# EAGLE schematic TAMSAT_OBC_v113 (EAGLE 6.5.0)

## Sheet 1 of 4
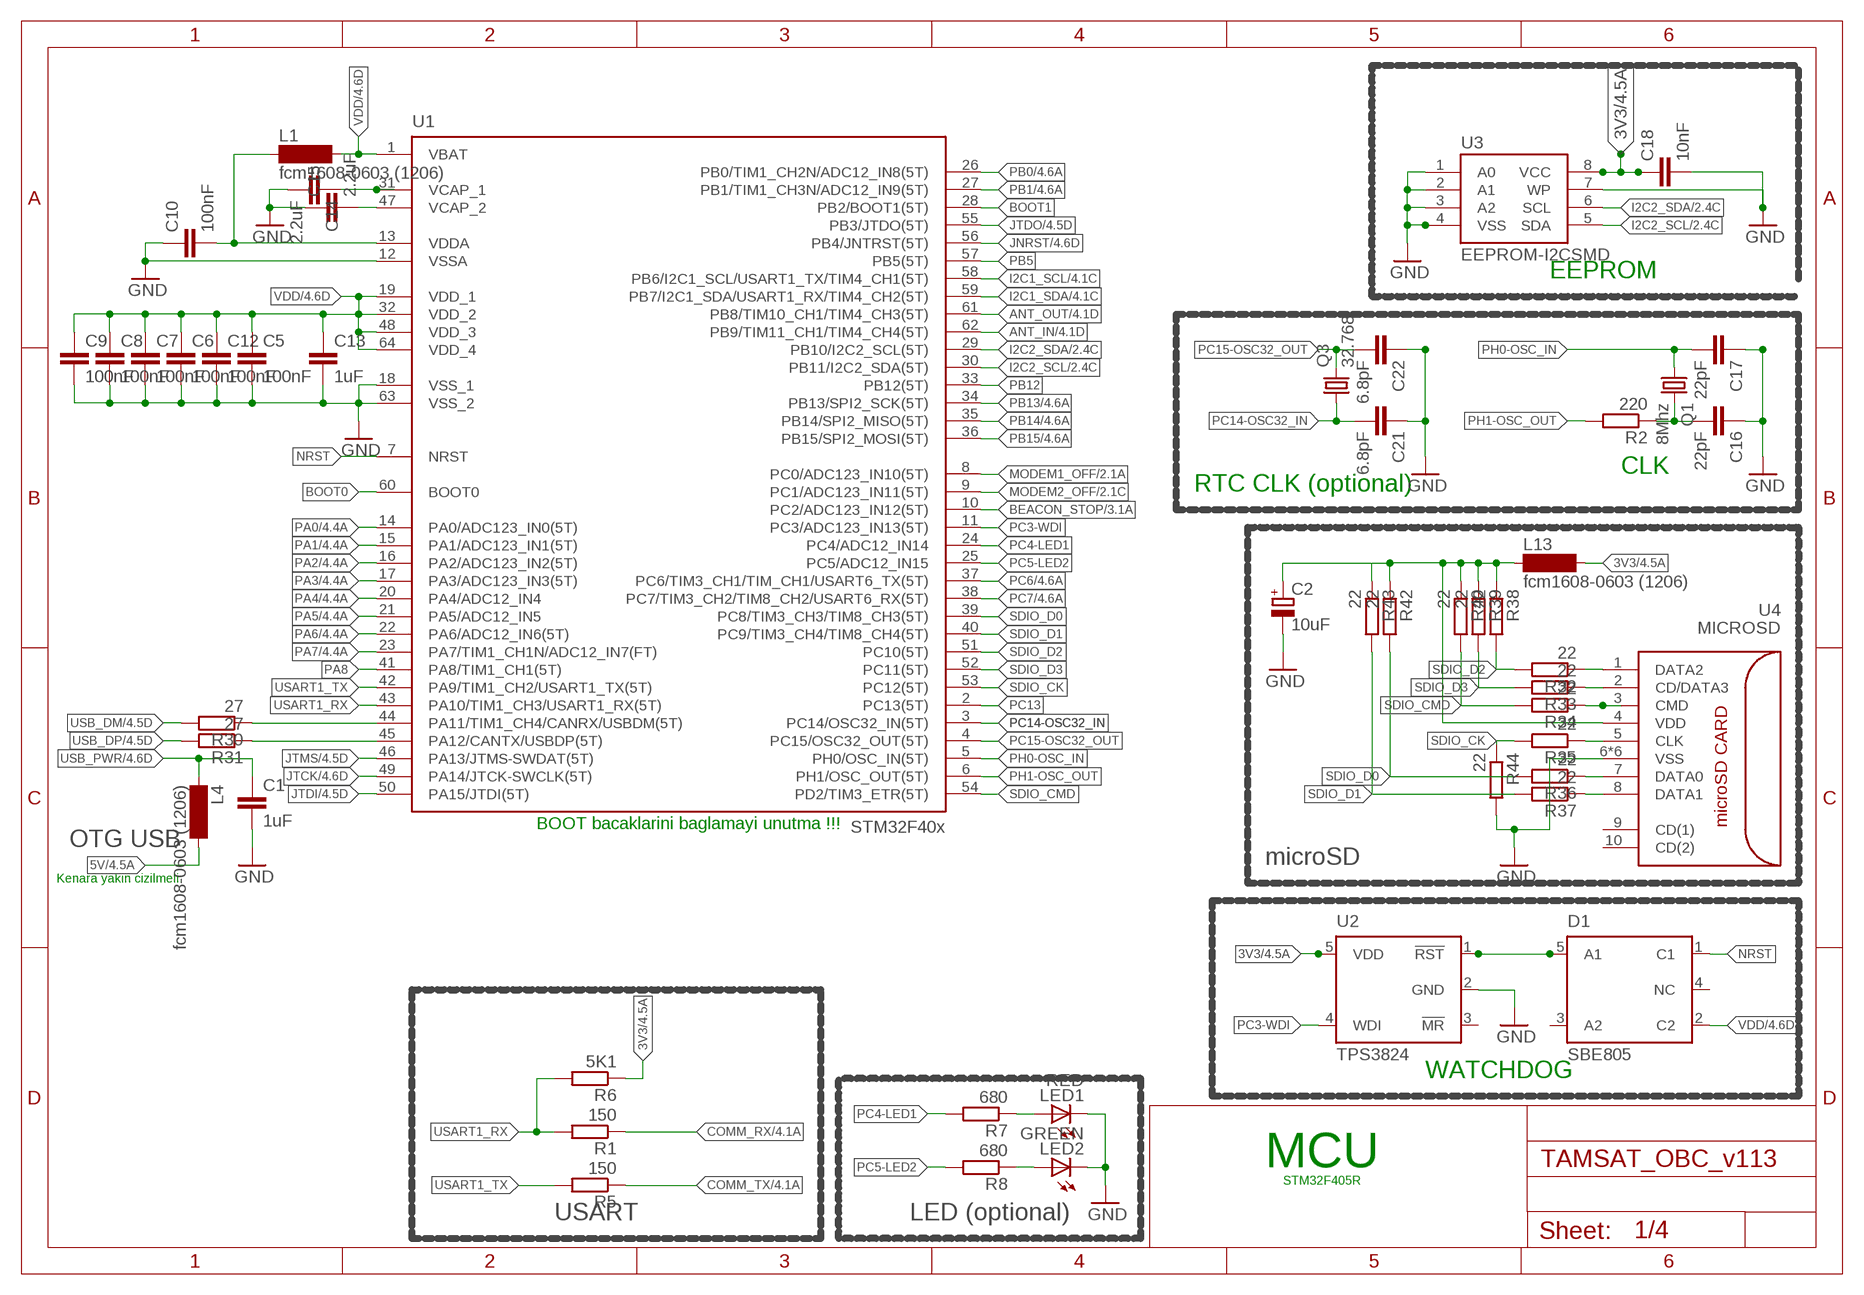
[diagram p0: schematic, sheet 1]

### Parts
C1  1uF  C-EUC0603K  [C0603K]
C2  10uF  C-TANTAL-A  [C1206(3216)]
C5  100nF  C-EUC0402K  [C0402K]
C6  100nF  C-EUC0402K  [C0402K]
C7  100nF  C-EUC0402K  [C0402K]
C8  100nF  C-EUC0402K  [C0402K]
C9  100nF  C-EUC0402K  [C0402K]
C10  100nF  C-EUC0603K  [C0603K]
C12  100nF  C-EUC0402K  [C0402K]
C13  1uF  C-EUC0805  [C0805]
C14  2.2uF  C-EUC0402K  [C0402K]
C15  2.2uF  C-EUC0402K  [C0402K]
C16  22pF  C-EUC0402K  [C0402K]
C17  22pF  C-EUC0402K  [C0402K]
C18  10nF  CAP0805  [0805]
C21  6.8pF  C-EUC0402K  [C0402K]
C22  6.8pF  C-EUC0402K  [C0402K]
D1  SBE805  [SOT-25]
L1  fcm1608-0603 (1206)  SM-1206  [SM-1206]
L4  fcm1608-0603 (1206)  SM-1206  [SM-1206]
L13  fcm1608-0603 (1206)  SM-1206  [SM-1206]
LED1  RED  LEDCHIPLED_0603  [CHIPLED_0603]
LED2  GREEN  LEDCHIP-LED0603  [CHIP-LED0603]
Q1  8Mhz  XTAL_8MHZ  [XTAL_SMD2]
Q3  32.768  MC-306  [MC-306]
R1  150  R-EU_R0402  [R0402]
R2  220  R-EU_R0402  [R0402]
R5  150  R-EU_R0402  [R0402]
R6  5K1  R-EU_R0402  [R0402]
R7  680  R-EU_R0402  [R0402]
R8  680  R-EU_R0402  [R0402]
R30  27  R-EU_R0402  [R0402]
R31  27  R-EU_R0402  [R0402]
R32  22  R-EU_R0402  [R0402]
R33  22  R-EU_R0402  [R0402]
R34  22  R-EU_R0402  [R0402]
R35  22  R-EU_R0402  [R0402]
R36  22  R-EU_R0402  [R0402]
R37  22  R-EU_R0402  [R0402]
R38  22  R-EU_R0402  [R0402]
R39  22  R-EU_R0402  [R0402]
R40  22  R-EU_R0402  [R0402]
R42  22  R-EU_R0402  [R0402]
R43  22  R-EU_R0402  [R0402]
R44  22  R-EU_R0402  [R0402]
U1  STM32F405R  [TQFP64]
U2  TPS3824  [SOT23-5]
U3  EEPROM-I2CSMD  [SO08]
U4  MICROSD  [MICROSD]

### Nets
3V3: C18.1 L13.2 R6.1 U2.5(VDD) U3.8(VCC) ; also sheet 4
5V: L4.2 ; also sheet 4
ANT_IN: U1.62(PB9/TIM11_CH1/TIM4_CH4(5T)) ; also sheet 4
ANT_OUT: U1.61(PB8/TIM10_CH1/TIM4_CH3(5T)) ; also sheet 4
BEACON_STOP: U1.10(PC2/ADC123_IN12(5T)) ; also sheet 3
BOOT0: U1.60(BOOT0)
BOOT1: U1.28(PB2/BOOT1(5T))
COMM_RX: R1.1 ; also sheet 4
COMM_TX: R5.1 ; also sheet 4
GND: C1.2 C2.2(-) C5.2 C6.2 C7.2 C8.2 C9.2 C10.1 C12.2 C13.2 C14.2 C15.1 C16.1 C17.1 C18.2 C21.1 C22.1 LED1.C LED2.C R44.2 U1.12(VSSA) U1.18(VSS_1) U1.63(VSS_2) U2.2(GND) U3.1(A0) U3.2(A1) U3.3(A2) U3.4(VSS) U3.7(WP) U4.6(VSS) U4.11(VSS) U4.12(VSS) U4.13(VSS) U4.14(VSS) U4.15(VSS) ; also sheet 2,3,4
I2C1_SCL: U1.58(PB6/I2C1_SCL/USART1_TX/TIM4_CH1(5T)) ; also sheet 4
I2C1_SDA: U1.59(PB7/I2C1_SDA/USART1_RX/TIM4_CH2(5T)) ; also sheet 4
I2C2_SCL: U1.30(PB11/I2C2_SDA(5T)) U3.5(SDA) ; also sheet 2,3,4
I2C2_SDA: U1.29(PB10/I2C2_SCL(5T)) U3.6(SCL) ; also sheet 2,3,4
JNRST: U1.56(PB4/JNTRST(5T)) ; also sheet 4
JTCK: U1.49(PA14/JTCK-SWCLK(5T)) ; also sheet 4
JTDI: U1.50(PA15/JTDI(5T)) ; also sheet 4
JTDO: U1.55(PB3/JTDO(5T)) ; also sheet 4
JTMS: U1.46(PA13/JTMS-SWDAT(5T)) ; also sheet 4
MODEM1_OFF: U1.8(PC0/ADC123_IN10(5T)) ; also sheet 2
MODEM2_OFF: U1.9(PC1/ADC123_IN11(5T)) ; also sheet 2
N$1: C14.1 U1.31(VCAP_1)
N$2: C15.2 U1.47(VCAP_2)
N$3: C10.2 L1.1 U1.13(VDDA)
N$5: R36.1 U4.7(DATA0)
N$6: C16.2 Q1.2 R2.1
N$12: LED1.A R7.1
N$13: LED2.A R8.1
N$14: D1.5(A1) U2.1(!RST)
N$69: R30.1 U1.44(PA11/TIM1_CH4/CANRX/USBDM(5T))
N$70: R31.1 U1.45(PA12/CANTX/USBDP(5T))
N$71: R32.1 U4.1(DATA2)
N$72: R33.1 U4.2(CD/DATA3)
N$73: R34.1 U4.3(CMD)
N$74: C2.1(+) L13.1 R38.1 R39.1 R40.1 R42.1 R43.1 U4.4(VDD)
N$75: R35.1 U4.5(CLK)
N$76: R37.1 U4.8(DATA1)
NRST: D1.1(C1) U1.7(NRST)
PA0: U1.14(PA0/ADC123_IN0(5T)) ; also sheet 4
PA1: U1.15(PA1/ADC123_IN1(5T)) ; also sheet 4
PA2: U1.16(PA2/ADC123_IN2(5T)) ; also sheet 4
PA3: U1.17(PA3/ADC123_IN3(5T)) ; also sheet 4
PA4: U1.20(PA4/ADC12_IN4) ; also sheet 4
PA5: U1.21(PA5/ADC12_IN5) ; also sheet 4
PA6: U1.22(PA6/ADC12_IN6(5T)) ; also sheet 4
PA7: U1.23(PA7/TIM1_CH1N/ADC12_IN7(FT)) ; also sheet 4
PA8: U1.41(PA8/TIM1_CH1(5T))
PB0: U1.26(PB0/TIM1_CH2N/ADC12_IN8(5T)) ; also sheet 4
PB1: U1.27(PB1/TIM1_CH3N/ADC12_IN9(5T)) ; also sheet 4
PB5: U1.57(PB5(5T))
PB12: U1.33(PB12(5T))
PB13: U1.34(PB13/SPI2_SCK(5T)) ; also sheet 4
PB14: U1.35(PB14/SPI2_MISO(5T)) ; also sheet 4
PB15: U1.36(PB15/SPI2_MOSI(5T)) ; also sheet 4
PC3-WDI: U1.11(PC3/ADC123_IN13(5T)) U2.4(WDI)
PC4-LED1: R7.2 U1.24(PC4/ADC12_IN14)
PC5-LED2: R8.2 U1.25(PC5/ADC12_IN15)
PC6: U1.37(PC6/TIM3_CH1/TIM_CH1/USART6_TX(5T)) ; also sheet 4
PC7: U1.38(PC7/TIM3_CH2/TIM8_CH2/USART6_RX(5T)) ; also sheet 4
PC13: U1.2(PC13(5T))
PC14-OSC32_IN: C21.2 Q3.1 U1.3(PC14/OSC32_IN(5T))
PC15-OSC32_OUT: C22.2 Q3.4 U1.4(PC15/OSC32_OUT(5T))
PH0-OSC_IN: C17.2 Q1.1 U1.5(PH0/OSC_IN(5T))
PH1-OSC_OUT: R2.2 U1.6(PH1/OSC_OUT(5T))
SDIO_CK: R35.2 R44.1 U1.53(PC12(5T))
SDIO_CMD: R34.2 R40.2 U1.54(PD2/TIM3_ETR(5T))
SDIO_D0: R36.2 R42.2 U1.39(PC8/TIM3_CH3/TIM8_CH3(5T))
SDIO_D1: R37.2 R43.2 U1.40(PC9/TIM3_CH4/TIM8_CH4(5T))
SDIO_D2: R32.2 R38.2 U1.51(PC10(5T))
SDIO_D3: R33.2 R39.2 U1.52(PC11(5T))
USART1_RX: R1.2 R6.2 U1.43(PA10/TIM1_CH3/USART1_RX(5T))
USART1_TX: R5.2 U1.42(PA9/TIM1_CH2/USART1_TX(5T))
USB_DM: R30.2 ; also sheet 4
USB_DP: R31.2 ; also sheet 4
USB_PWR: C1.1 L4.1 ; also sheet 4
VDD: C5.1 C6.1 C7.1 C8.1 C9.1 C12.1 C13.1 D1.2(C2) L1.2 U1.1(VBAT) U1.19(VDD_1) U1.32(VDD_2) U1.48(VDD_3) U1.64(VDD_4) ; also sheet 4
Unconnected: D1.3(A2) D1.4(NC) U2.3(!MR) U4.9(CD(1)) U4.10(CD(2))

### Notes on the sheet
- EEPROM
- CLK
- RTC CLK (optional)
- OTG USB | BOOT bacaklarini baglamayi unutma !!!
- microSD
- Kenara yakin cizilmeli
- WATCHDOG
- MCU
- STM32F405R
- USART | LED (optional)

## Sheet 2 of 4
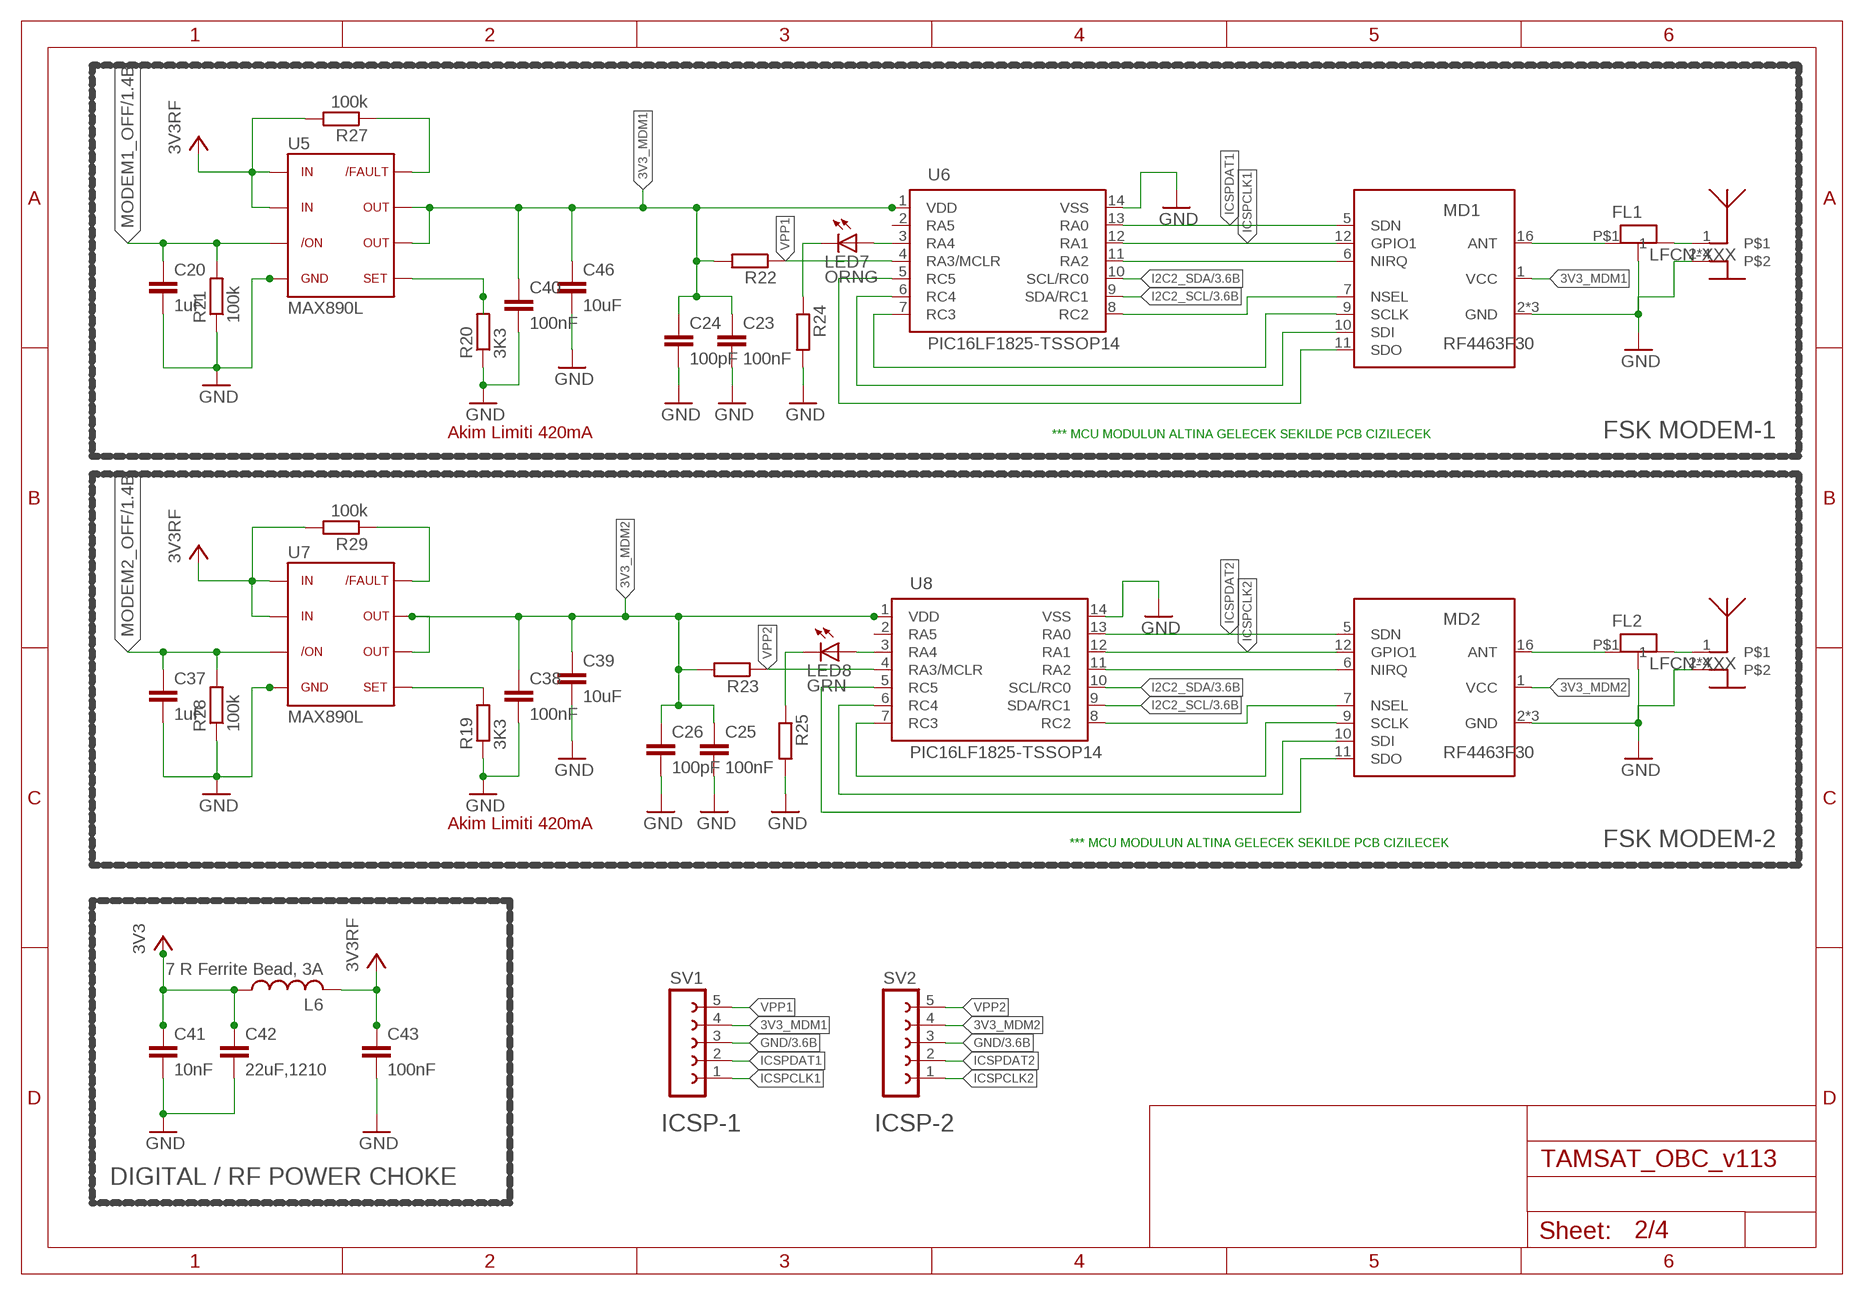
[diagram p1: schematic, sheet 2]

### Parts
C20  1uF  C-EUC0805K  [C0805K]
C23  100nF  C-EUC0805K  [C0805K]
C24  100pF  C-EUC0805K  [C0805K]
C25  100nF  C-EUC0805K  [C0805K]
C26  100pF  C-EUC0805K  [C0805K]
C37  1uF  C-EUC0805K  [C0805K]
C38  100nF  C-EUC0805K  [C0805K]
C39  10uF  C-EUC1206K  [C1206K]
C40  100nF  C-EUC0805K  [C0805K]
C41  10nF  C-EUC0805K  [C0805K]
C42  22uF,1210  C1206(3216)-GCM31  [C1206-GCM31]
C43  100nF  C-EUC0805K  [C0805K]
C46  10uF  C-EUC1206K  [C1206K]
FL1  LFCN-XXX  [LFCN-XXX]
FL2  LFCN-XXX  [LFCN-XXX]
L6  7 R Ferrite Bead, 3A  L  [L805]
LED7  ORNG  LEDCHIP-LED0805  [CHIP-LED0805]
LED8  GRN  LEDCHIP-LED0805  [CHIP-LED0805]
MD1  RF4463F30  [RF4463F30]
MD2  RF4463F30  [RF4463F30]
R19  3K3  R-EU_R0805  [R0805]
R20  3K3  R-EU_R0805  [R0805]
R21  100k  R-EU_R0805  [R0805]
R22  R-EU_R0805  [R0805]
R23  R-EU_R0805  [R0805]
R24  R-EU_R0805  [R0805]
R25  R-EU_R0805  [R0805]
R27  100k  R-EU_R0805  [R0805]
R28  100k  R-EU_R0805  [R0805]
R29  100k  R-EU_R0805  [R0805]
SV1  FE05-1  [FE05-1]
SV2  FE05-1  [FE05-1]
U5  MAX890L  [SO8]
U6  PIC16LF1825-TSSOP14  [TSSOP14]
U7  MAX890L  [SO8]
U8  PIC16LF1825-TSSOP14  [TSSOP14]
U$1  SMA-KONNEKTOR  [SMA]
U$3  SMA-KONNEKTOR  [SMA]

### Nets
3.3VBEACON: C41.1 C42.P$1 L6.1 ; supply symbol labelled 3V3
3V3_MDM1: C23.1 C24.1 C40.1 C46.1 MD1.1(VCC) R22.2 SV1.4 U5.6 U5.7 U6.1(VDD)
3V3_MDM2: C25.1 C26.1 C38.1 C39.1 MD2.1(VCC) R23.2 SV2.4 U7.6 U7.7 U8.1(VDD)
GND: C20.2 C23.2 C24.2 C25.2 C26.2 C37.2 C38.2 C39.2 C40.2 C41.2 C42.P$2 C43.2 C46.2 FL1.P$3 FL1.P$4 FL2.P$3 FL2.P$4 MD1.2(GND) MD1.8(GND) MD1.15(GND) MD2.2(GND) MD2.8(GND) MD2.15(GND) R19.1 R20.1 R21.1 R24.2 R25.2 R28.1 SV1.3 SV2.3 U5.4 U6.14(VSS) U7.4 U8.14(VSS) U$1.2 U$1.3 U$1.4 U$1.5 U$3.2 U$3.3 U$3.4 U$3.5 ; also sheet 1,3,4
I2C2_SCL: U6.9(SDA/RC1) U8.9(SDA/RC1) ; also sheet 1,3,4
I2C2_SDA: U6.10(SCL/RC0) U8.10(SCL/RC0) ; also sheet 1,3,4
ICSPCLK1: MD1.12(GPIO1) SV1.1 U6.12(RA1)
ICSPCLK2: MD2.12(GPIO1) SV2.1 U8.12(RA1)
ICSPDAT1: MD1.5(SDN) SV1.2 U6.13(RA0)
ICSPDAT2: MD2.5(SDN) SV2.2 U8.13(RA0)
MODEM1_OFF: C20.1 R21.2 U5.3 ; also sheet 1
MODEM2_OFF: C37.1 R28.2 U7.3 ; also sheet 1
N$20: FL1.P$1 MD1.16(ANT)
N$24: MD1.6(NIRQ) U6.11(RA2)
N$25: MD1.7(NSEL) U6.8(RC2)
N$26: MD1.9(SCLK) U6.7(RC3)
N$27: MD1.10(SDI) U6.6(RC4)
N$28: MD1.11(SDO) U6.5(RC5)
N$29: FL2.P$1 MD2.16(ANT)
N$34: MD2.6(NIRQ) U8.11(RA2)
N$35: MD2.7(NSEL) U8.8(RC2)
N$36: MD2.9(SCLK) U8.7(RC3)
N$37: MD2.10(SDI) U8.6(RC4)
N$38: MD2.11(SDO) U8.5(RC5)
N$39: R20.2 U5.5
N$52: R27.1 U5.8
N$53: R19.2 U7.5
N$55: R29.1 U7.8
N$57: LED7.C R24.1
N$58: LED7.A U6.3(RA4)
N$60: LED8.C R25.1
N$61: LED8.A U8.3(RA4)
N$77: FL1.P$2 U$1.1
N$78: FL2.P$2 U$3.1
VCCRF: C43.1 L6.2 R27.2 R29.2 U5.1 U5.2 U7.1 U7.2 ; supply symbol labelled 3V3RF
VPP1: R22.1 SV1.5 U6.4(RA3/MCLR)
VPP2: R23.1 SV2.5 U8.4(RA3/MCLR)
Unconnected: U6.2(RA5) U8.2(RA5)

### Notes on the sheet
- Akim Limiti 420mA | *** MCU MODULUN ALTINA GELECEK SEKILDE PCB CIZILECEK | FSK MODEM-1
- Akim Limiti 420mA
- *** MCU MODULUN ALTINA GELECEK SEKILDE PCB CIZILECEK | FSK MODEM-2
- ICSP-1 | ICSP-2
- DIGITAL / RF POWER CHOKE

## Sheet 3 of 4
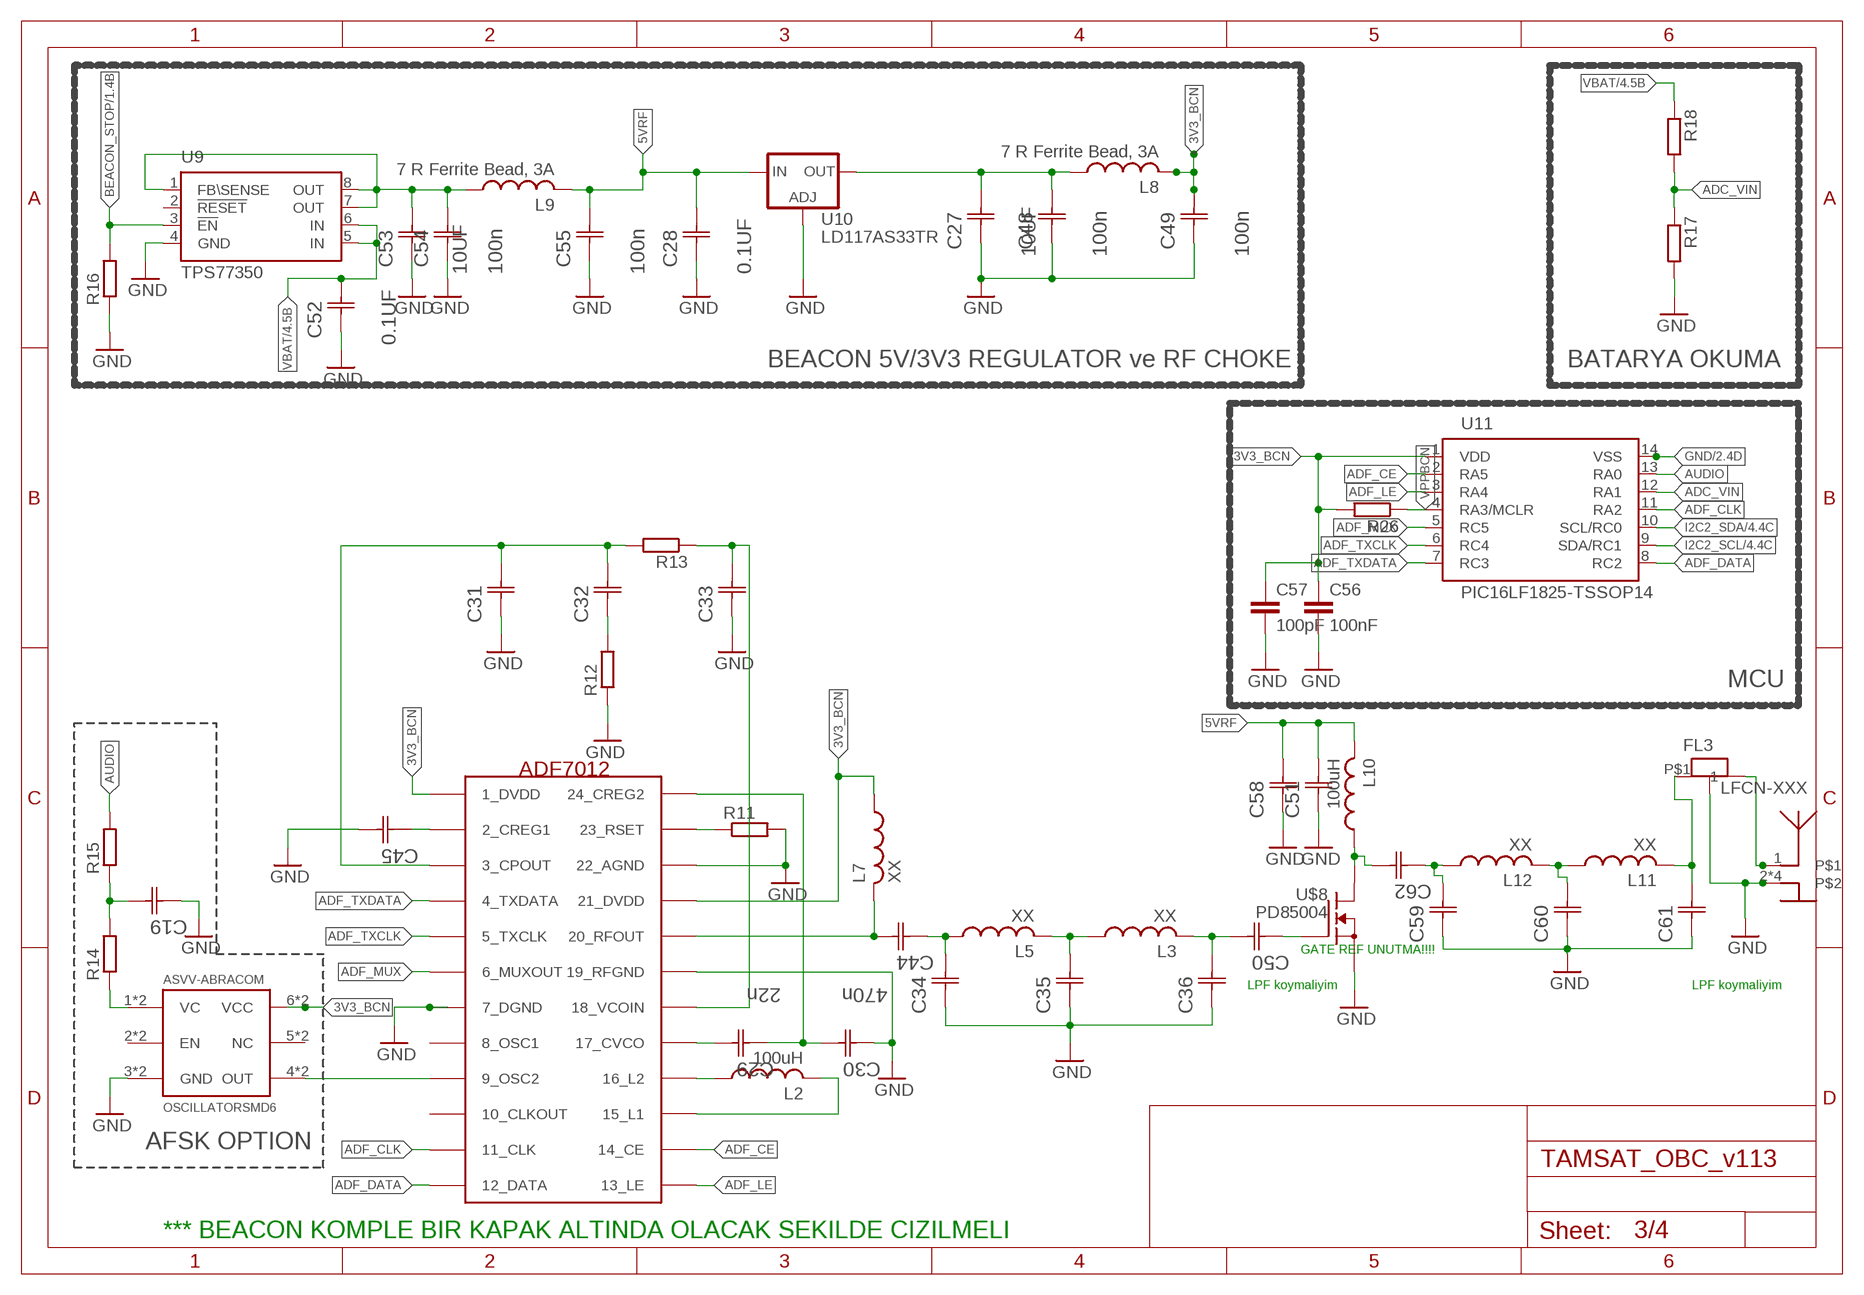
[diagram p2: schematic, sheet 3]

### Parts
ASVV-ABRACOM  OSCILLATORSMD6  [CRYSTAL-SMD-7.5X5.2-6PIN]
C19  0805YD106MAT2A  [CAPC2013X140N]
C27  10UF  0805YD106MAT2A  [CAPC2013X140N]
C28  0.1UF  0805ZC104MAT2A  [CAPC2012X94N]
C29  22n  0805ZC104MAT2A  [CAPC2012X94N]
C30  470n  0805ZC104MAT2A  [CAPC2012X94N]
C31  0805YD106MAT2A  [CAPC2013X140N]
C32  0805YD106MAT2A  [CAPC2013X140N]
C33  0805YD106MAT2A  [CAPC2013X140N]
C34  0805YD106MAT2A  [CAPC2013X140N]
C35  0805YD106MAT2A  [CAPC2013X140N]
C36  0805YD106MAT2A  [CAPC2013X140N]
C44  0805ZC104MAT2A  [CAPC2012X94N]
C45  0805ZC104MAT2A  [CAPC2012X94N]
C48  100n  0805YD106MAT2A  [CAPC2013X140N]
C49  100n  0805YD106MAT2A  [CAPC2013X140N]
C50  0805ZC104MAT2A  [CAPC2012X94N]
C51  0805YD106MAT2A  [CAPC2013X140N]
C52  0.1UF  0805ZC104MAT2A  [CAPC2012X94N]
C53  10UF  0805YD106MAT2A  [CAPC2013X140N]
C54  100n  0805YD106MAT2A  [CAPC2013X140N]
C55  100n  0805YD106MAT2A  [CAPC2013X140N]
C56  100nF  C-EUC0805K  [C0805K]
C57  100pF  C-EUC0805K  [C0805K]
C58  0805YD106MAT2A  [CAPC2013X140N]
C59  0805YD106MAT2A  [CAPC2013X140N]
C60  0805YD106MAT2A  [CAPC2013X140N]
C61  0805YD106MAT2A  [CAPC2013X140N]
C62  0805ZC104MAT2A  [CAPC2012X94N]
FL3  LFCN-XXX  [LFCN-XXX]
L2  100uH  L-USL2825P  [L2825P]
L3  XX  L-USL2825P  [L2825P]
L5  XX  L-USL2825P  [L2825P]
L7  XX  L-USL2825P  [L2825P]
L8  7 R Ferrite Bead, 3A  L  [L805]
L9  7 R Ferrite Bead, 3A  L  [L805]
L10  100uH  L-USL2825P  [L2825P]
L11  XX  L-USL2825P  [L2825P]
L12  XX  L-USL2825P  [L2825P]
R11  R-EU_R0402  [R0402]
R12  R-EU_R0805  [R0805]
R13  R-EU_R0805  [R0805]
R14  R-EU_R0402  [R0402]
R15  R-EU_R0402  [R0402]
R16  R-EU_R0805  [R0805]
R17  R-EU_R0805  [R0805]
R18  R-EU_R0805  [R0805]
R26  R-EU_R0805  [R0805]
U9  TPS77350  [SOP-08]
U10  LD117AS33TR  [SOT223]
U11  PIC16LF1825-TSSOP14  [TSSOP14]
U12  ADF7012  [ADF7012]
U$6  SMA-KONNEKTOR  [SMA]
U$8  PD85004  [SOT-89]

### Nets
3V3_BCN: ASVV-ABRACOM.6(VCC) ASVV-ABRACOM.6INNER(VCC) C49.2(C2) C56.1 C57.1 L7.1 L8.2 R26.2 U11.1(VDD) U12.1_DVDD U12.21_DVDD
5VRF: C28.2(C2) C51.2(C2) C55.2(C2) C58.2(C2) L9.2 L10.2 U10.3(IN)
ADC_VIN: R17.1 R18.2 U11.12(RA1)
ADF_CE: U11.2(RA5) U12.14_CE
ADF_CLK: U11.11(RA2) U12.11_CLK
ADF_DATA: U11.8(RC2) U12.12_DATA
ADF_LE: U11.3(RA4) U12.13_LE
ADF_MUX: U11.5(RC5) U12.6_MUXOUT
ADF_TXCLK: U11.6(RC4) U12.5_TXCLK
ADF_TXDATA: U11.7(RC3) U12.4_TXDATA
AUDIO: R15.2 U11.13(RA0)
BEACON_STOP: R16.2 U9.3(!EN) ; also sheet 1
GND: ASVV-ABRACOM.3(GND) ASVV-ABRACOM.3INNER(GND) C19.1(C1) C27.1(C1) C28.1(C1) C30.1(C1) C31.1(C1) C33.1(C1) C34.1(C1) C35.1(C1) C36.1(C1) C45.2(C2) C48.1(C1) C49.1(C1) C51.1(C1) C52.1(C1) C53.1(C1) C54.1(C1) C55.1(C1) C56.2 C57.2 C58.1(C1) C59.1(C1) C60.1(C1) C61.1(C1) FL3.P$3 FL3.P$4 R11.2 R12.1 R16.1 R17.2 U9.4(GND) U10.1(ADJ) U11.14(VSS) U12.7_DGND U12.19_RFGND U12.22_AGND U$6.2 U$6.3 U$6.4 U$6.5 U$8.2(S) U$8.2@1(S) ; also sheet 1,2,4
I2C2_SCL: U11.9(SDA/RC1) ; also sheet 1,2,4
I2C2_SDA: U11.10(SCL/RC0) ; also sheet 1,2,4
N$7: ASVV-ABRACOM.4(OUT) ASVV-ABRACOM.4INNER(OUT) U12.9_OSC2
N$8: R11.1 U12.23_RSET
N$9: L2.1 U12.16_L2
N$15: L2.2 U12.15_L1
N$16: C29.2(C2) U12.17_CVCO
N$17: C29.1(C1) C30.2(C2) U12.24_CREG2
N$18: C31.2(C2) C32.2(C2) R13.2 U12.3_CPOUT
N$19: C33.2(C2) R13.1 U12.18_VCOIN
N$32: C60.2(C2) L11.1 L12.2
N$40: C62.2(C2) L10.1 U$8.3(D)
N$41: C32.1(C1) R12.2
N$42: C44.2(C2) L7.2 U12.20_RFOUT
N$43: C35.2(C2) L3.1 L5.2
N$44: C34.2(C2) C44.1(C1) L5.1
N$45: C36.2(C2) C50.2(C2) L3.2
N$46: FL3.P$2 U$6.1
N$47: C45.1(C1) U12.2_CREG1
N$48: ASVV-ABRACOM.1(VC) ASVV-ABRACOM.1INNER(VC) R14.1
N$49: C19.2(C2) R14.2 R15.1
N$56: C50.1(C1) U$8.1(G)
N$63: C27.2(C2) C48.2(C2) L8.1 U10.4(OUT)
N$65: C53.2(C2) C54.2(C2) L9.1 U9.1(FB\SENSE) U9.7(OUT) U9.8(OUT)
N$66: C59.2(C2) C62.1(C1) L12.1
N$97: C61.2(C2) FL3.P$1 L11.2
VBAT: C52.2(C2) R18.1 U9.5(IN) U9.6(IN) ; also sheet 4
VPPBCN: R26.1 U11.4(RA3/MCLR)
Unconnected: ASVV-ABRACOM.2(EN) ASVV-ABRACOM.2INNER(EN) ASVV-ABRACOM.5(NC) ASVV-ABRACOM.5INNER(NC) U9.2(!RESET) U12.8_OSC1 U12.10_CLKOUT

### Notes on the sheet
- BATARYA OKUMA
- BEACON 5V/3V3 REGULATOR ve RF CHOKE
- MCU
- GATE REF UNUTMA!!!!
- LPF koymaliyim | LPF koymaliyim
- AFSK OPTION
- *** BEACON KOMPLE BIR KAPAK ALTINDA OLACAK SEKILDE CIZILMELI

## Sheet 4 of 4
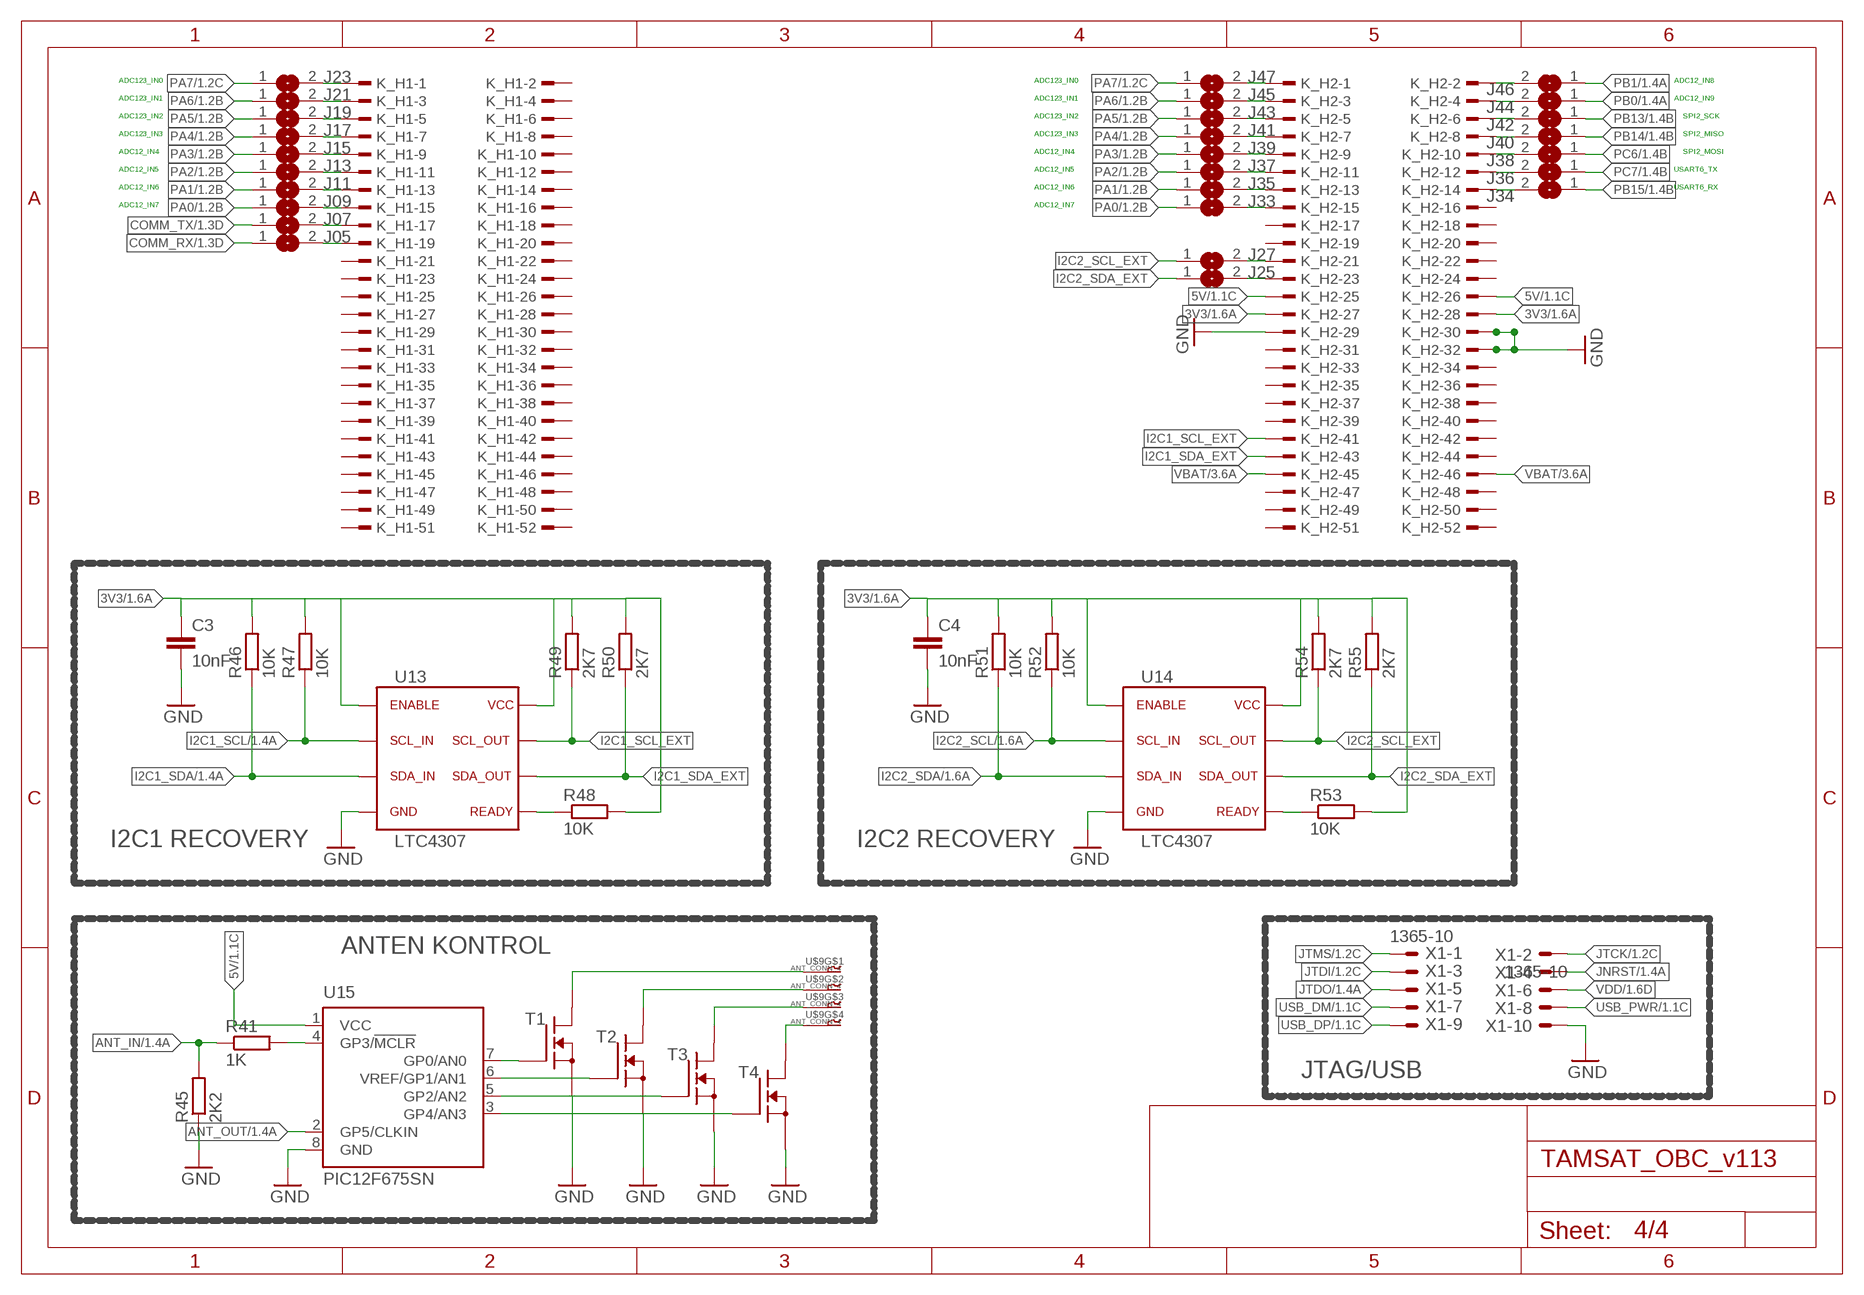
[diagram p3: schematic, sheet 4]

### Parts
C3  10nF  C-EUC0805K  [C0805K]
C4  10nF  C-EUC0805K  [C0805K]
J05  JUMPER_MINI  [JUMPER_MINI]
J07  JUMPER_MINI  [JUMPER_MINI]
J09  JUMPER_MINI  [JUMPER_MINI]
J11  JUMPER_MINI  [JUMPER_MINI]
J13  JUMPER_MINI  [JUMPER_MINI]
J15  JUMPER_MINI  [JUMPER_MINI]
J17  JUMPER_MINI  [JUMPER_MINI]
J19  JUMPER_MINI  [JUMPER_MINI]
J21  JUMPER_MINI  [JUMPER_MINI]
J23  JUMPER_MINI  [JUMPER_MINI]
J25  JUMPER_MINI  [JUMPER_MINI]
J27  JUMPER_MINI  [JUMPER_MINI]
J33  JUMPER_MINI  [JUMPER_MINI]
J34  JUMPER_MINI  [JUMPER_MINI]
J35  JUMPER_MINI  [JUMPER_MINI]
J36  JUMPER_MINI  [JUMPER_MINI]
J37  JUMPER_MINI  [JUMPER_MINI]
J38  JUMPER_MINI  [JUMPER_MINI]
J39  JUMPER_MINI  [JUMPER_MINI]
J40  JUMPER_MINI  [JUMPER_MINI]
J41  JUMPER_MINI  [JUMPER_MINI]
J42  JUMPER_MINI  [JUMPER_MINI]
J43  JUMPER_MINI  [JUMPER_MINI]
J44  JUMPER_MINI  [JUMPER_MINI]
J45  JUMPER_MINI  [JUMPER_MINI]
J46  JUMPER_MINI  [JUMPER_MINI]
J47  JUMPER_MINI  [JUMPER_MINI]
K_  CUBESAT_HEADER  [CUBESAT_BRD]
R41  1K  R-EU_R0805  [R0805]
R45  2K2  R-EU_R0805  [R0805]
R46  10K  R-EU_R0805  [R0805]
R47  10K  R-EU_R0805  [R0805]
R48  10K  R-EU_R0805  [R0805]
R49  2K7  R-EU_R0805  [R0805]
R50  2K7  R-EU_R0805  [R0805]
R51  10K  R-EU_R0805  [R0805]
R52  10K  R-EU_R0805  [R0805]
R53  10K  R-EU_R0805  [R0805]
R54  2K7  R-EU_R0805  [R0805]
R55  2K7  R-EU_R0805  [R0805]
T1  PD85004  [SOT-89]
T2  PD85004  [SOT-89]
T3  PD85004  [SOT-89]
T4  PD85004  [SOT-89]
U13  LTC4307  [DGK-R-PDSO-G8]
U14  LTC4307  [DGK-R-PDSO-G8]
U15  PIC12F675SN  [SO-08]
U$9  ANT_CONN_4  [ANT_CON]
X1  1365-10  [1365-10]

### Nets
3V3: C3.1 C4.1 K_.79 K_.80 R46.2 R47.2 R48.2 R49.2 R50.2 R51.2 R52.2 R53.2 R54.2 R55.2 U13.1 U13.8 U14.1 U14.8 ; also sheet 1
5V: K_.77 K_.78 U15.1(VCC) ; also sheet 1
ANT_IN: R41.1 R45.2 ; also sheet 1
ANT_OUT: U15.2(GP5/CLKIN) ; also sheet 1
COMM_RX: J05.1 ; also sheet 1
COMM_TX: J07.1 ; also sheet 1
GND: C3.2 C4.2 K_.81 K_.82 K_.84 R45.1 T1.2(S) T1.2@1(S) T2.2(S) T2.2@1(S) T3.2(S) T3.2@1(S) T4.2(S) T4.2@1(S) U13.4 U14.4 U15.8(GND) X1.10 ; also sheet 1,2,3
I2C1_SCL: R47.1 U13.2 ; also sheet 1
I2C1_SCL_EXT: K_.93 R49.1 U13.7
I2C1_SDA: R46.1 U13.3 ; also sheet 1
I2C1_SDA_EXT: K_.95 R50.1 U13.6
I2C2_SCL: R52.1 U14.2 ; also sheet 1,2,3
I2C2_SCL_EXT: J27.1 R54.1 U14.7
I2C2_SDA: R51.1 U14.3 ; also sheet 1,2,3
I2C2_SDA_EXT: J25.1 R55.1 U14.6
JNRST: X1.4 ; also sheet 1
JTCK: X1.2 ; also sheet 1
JTDI: X1.3 ; also sheet 1
JTDO: X1.5 ; also sheet 1
JTMS: X1.1 ; also sheet 1
N$4: J23.2 K_.1
N$22: J21.2 K_.3
N$31: R41.2 U15.4(GP3/!MCLR)
N$50: T1.1(G) U15.7(GP0/AN0)
N$51: T2.1(G) U15.6(VREF/GP1/AN1)
N$54: T3.1(G) U15.5(GP2/AN2)
N$59: T4.1(G) U15.3(GP4/AN3)
N$62: T4.3(D) U$9.4
N$64: J19.2 K_.5
N$67: T3.3(D) U$9.3
N$68: T2.3(D) U$9.2
N$79: T1.3(D) U$9.1
N$82: R48.1 U13.5
N$83: R53.1 U14.5
N$87: J17.2 K_.7
N$88: J15.2 K_.9
N$89: J13.2 K_.11
N$90: J11.2 K_.13
N$91: J09.2 K_.15
N$92: J07.2 K_.17
N$93: J05.2 K_.19
N$101: J34.2 K_.66
N$102: J36.2 K_.64
N$103: J38.2 K_.62
N$104: J40.2 K_.60
N$105: J42.2 K_.58
N$106: J44.2 K_.56
N$107: J47.2 K_.53
N$108: J45.2 K_.55
N$112: J43.2 K_.57
N$113: J41.2 K_.59
N$114: J39.2 K_.61
N$115: J37.2 K_.63
N$116: J35.2 K_.65
N$117: J33.2 K_.67
N$120: J27.2 K_.73
N$121: J25.2 K_.75
N$122: J46.2 K_.54
PA0: J09.1 J33.1 ; also sheet 1
PA1: J11.1 J35.1 ; also sheet 1
PA2: J13.1 J37.1 ; also sheet 1
PA3: J15.1 J39.1 ; also sheet 1
PA4: J17.1 J41.1 ; also sheet 1
PA5: J19.1 J43.1 ; also sheet 1
PA6: J21.1 J45.1 ; also sheet 1
PA7: J23.1 J47.1 ; also sheet 1
PB0: J44.1 ; also sheet 1
PB1: J46.1 ; also sheet 1
PB13: J42.1 ; also sheet 1
PB14: J40.1 ; also sheet 1
PB15: J34.1 ; also sheet 1
PC6: J38.1 ; also sheet 1
PC7: J36.1 ; also sheet 1
USB_DM: X1.7 ; also sheet 1
USB_DP: X1.9 ; also sheet 1
USB_PWR: X1.8 ; also sheet 1
VBAT: K_.97 K_.98 ; also sheet 3
VDD: X1.6 ; also sheet 1
Unconnected: K_.2 K_.4 K_.6 K_.8 K_.10 K_.12 K_.14 K_.16 K_.18 K_.20 K_.21 K_.22 K_.23 K_.24 K_.25 K_.26 K_.27 K_.28 K_.29 K_.30 K_.31 K_.32 K_.33 K_.34 K_.35 K_.36 K_.37 K_.38 K_.39 K_.40 K_.41 K_.42 K_.43 K_.44 K_.45 K_.46 K_.47 K_.48 K_.49 K_.50 K_.51 K_.52 K_.68 K_.69 K_.70 K_.71 K_.72 K_.74 K_.76 K_.83 K_.85 K_.86 K_.87 K_.88 K_.89 K_.90 K_.91 K_.92 K_.94 K_.96 K_.99 K_.100 K_.101 K_.102 K_.103 K_.104

### Notes on the sheet
- ADC123_IN0 | ADC123_IN0 | ADC12_IN8
- ADC123_IN1 | ADC123_IN1 | ADC12_IN9
- ADC123_IN2 | ADC123_IN2 | SPI2_SCK
- ADC123_IN3 | ADC123_IN3 | SPI2_MISO
- ADC12_IN4 | ADC12_IN4 | SPI2_MOSI
- ADC12_IN5 | ADC12_IN5 | USART6_TX
- ADC12_IN6 | ADC12_IN6 | USART6_RX
- ADC12_IN7 | ADC12_IN7
- I2C1 RECOVERY | I2C2 RECOVERY
- ANTEN KONTROL
- JTAG/USB

## Library data of the parts
ASVV-ABRACOM = SparkFun-FreqCtrl_TK:OSCILLATOR: Generic 5x3 and 7x5 oscillators
C1 C3-C10 C12-C17 C20-C26 C37-C41 C43 C46 C56 C57 = rcl:C-EU: CAPACITOR, European symbol
C2 = OSSIdonghee:C-TANTAL-A: TAJA105M020RNJ Tantal Capacitor Manufacturer: AVX 1206(3126) Ref: www.avx.com/docs/techinfo/tantappl.pdf
C18 = SparkFun:CAP: Capacitor Standard 0603 ceramic capacitor, and 0.1" leaded capacitor.
C19 C31-C36 C48 C49 C51 C54 C55 C58-C61 = AVX_By_element14_Batch_1:0805YD106MAT2A: Capacitor 0805; MPN: 0805YD106MAT2A; OC_FARNELL: 1582704; OC_NEWARK: 66M3391; SUPPLIER: AVX; TOLERANCE: ±20%; VALUE: 10UF; VOLTAGERATING: 16V
C27 C53 = AVX_By_element14_Batch_1:0805YD106MAT2A: Capacitor 0805; MPN: 0805YD106MAT2A; OC_FARNELL: 1582704; OC_NEWARK: 66M3391; SUPPLIER: AVX; TOLERANCE: ±20%; VOLTAGERATING: 16V
C28 C52 = AVX_By_element14_Batch_1:0805ZC104MAT2A: Capacitor 0805; MPN: 0805ZC104MAT2A; OC_FARNELL: -; OC_NEWARK: 55J5552; SUPPLIER: AVX; TOLERANCE: ±20%; VOLTAGERATING: 10V
C29 C30 C44 C45 C50 C62 = AVX_By_element14_Batch_1:0805ZC104MAT2A: Capacitor 0805; MPN: 0805ZC104MAT2A; OC_FARNELL: -; OC_NEWARK: 55J5552; SUPPLIER: AVX; TOLERANCE: ±20%; VALUE: 0.1UF; VOLTAGERATING: 10V
C42 = OSSI:C
D1 = TAMSAT:SBE805
FL1-FL3 = TAMSAT:LFCN-XXX
J05 J07 J09 J11 J13 J15 J17 J19 J21 J23 J25 J27 J33-J47 = TAMSAT:JUMPER_MINI
K_ = TAMSAT:CUBESAT_HEADER
L1 L4 L13 = inductor-neosid:SM-1206: INDUCTOR SMD chip inductor; OC_FARNELL: unknown; OC_NEWARK: unknown
L2 L3 L5 L7 L10-L12 = resistor:L-US: INDUCTOR, American symbol
L6 L8 L9 = TAMSAT:L
LED1 LED2 LED7 LED8 = led:LED: LED OSRAM: - CHIPLED LG R971, LG N971, LY N971, LG Q971, LY Q971, LO R971, LY R971 LH N974, LH R974 LS Q976, LO Q976, LY Q976 LO Q996 - Hyper CHIPLED LW Q18S LB Q993, LB Q99A, LB R99A - SideLED LS A670, LO A670, LY A670, LG A670, LP A670 LB A673, LV A673, LT A673, LW A673 LH A674 LY A675 LS A676, LA A676, LO A676, LY A676, LW A676 LS A679, LY A679, LG A679 - Hyper Micro SIDELED® LS Y876, LA Y876, LO Y876, LY Y876 LT Y87S - SmartLED LW L88C, LW L88S LB L89C, LB L89S, LG L890 LS L89K, LO L89K, LY L89K LS L896, LA L896, LO L896, LY L896 - TOPLED LS T670, LO T670, LY T670, LG T670, LP T670 LSG T670, LSP T670, LSY T670, LOP T670, LYG T670 LG T671, LOG T671, LSG T671 LB T673, LV T673, LT T673, LW T673 LH T674 LS T676, LA T676, LO T676, LY T676, LB T676, LH T676, LSB T676, LW T676 LB T67C, LV T67C, LT T67C, LS T67K, LO T67K, LY T67K, LW E67C LS E67B, LA E67B, LO E67B, LY E67B, LB E67C, LV E67C, LT E67C LW T67C LS T679, LY T679, LG T679 LS T770, LO T770, LY T770, LG T770, LP T770 LB T773, LV T773, LT T773, LW T773 LH T774 LS E675, LA E675, LY E675, LS T675 LS T776, LA T776, LO T776, LY T776, LB T776 LHGB T686 LT T68C, LB T68C - Hyper Mini TOPLED® LB M676 - Mini TOPLED Santana® LG M470 LS M47K, LO M47K, LY M47K Source: http://www.osram.convergy.de LUXEON: - LUMILED® LXK2-PW12-R00, LXK2-PW12-S00, LXK2-PW14-U00, LXK2-PW14-V00 LXK2-PM12-R00, LXK2-PM12-S00, LXK2-PM14-U00 LXK2-PE12-Q00, LXK2-PE12-R00, LXK2-PE12-S00, LXK2-PE14-T00, LXK2-PE14-U00 LXK2-PB12-K00, LXK2-PB12-L00, LXK2-PB12-M00, LXK2-PB14-N00, LXK2-PB14-P00, LXK2-PB14-Q00 LXK2-PR12-L00, LXK2-PR12-M00, LXK2-PR14-Q00, LXK2-PR14-R00 LXK2-PD12-Q00, LXK2-PD12-R00, LXK2-PD12-S00 LXK2-PH12-R00, LXK2-PH12-S00 LXK2-PL12-P00, LXK2-PL12-Q00, LXK2-PL12-R00 Source: www.luxeon.com KINGBRIGHT: KA-3528ASYC Source: www.kingbright.com
MD1 MD2 = TAMSAT:RF4463F30
Q1 = TAMSAT:XTAL_8MHZ
Q3 = crystal:MC-306: kHz RANGE CRYSTAL UNIT SMD Source: MC-306_405_406_E07X.PDF Homepage <http://www.epsontoyocom.co.jp>; MPN: MC-306 60.0KHZ 100PPM ,12.5PF; OC_FARNELL: 1278040; OC_NEWARK: 31M5576
R1 R2 R5-R8 R11-R55 = rcl:R-EU_: RESISTOR, European symbol
SV1 SV2 = con-lsta:FE05-1: FEMALE HEADER; OC_FARNELL: unknown; OC_NEWARK: unknown
T1-T4 U$8 = TAMSAT:PD85004
U1 = TAMSAT:STM32F405R
U2 = TAMSAT:TPS3824
U3 = SparkFun-DigitalIC:EEPROM-I2C: I2C EEPROM chips, 24LC256 (and others)
U4 = TAMSAT:MICROSD
U5 U7 = TAMSAT:MAX890L
U6 U8 U11 = TAMSAT:PIC16LF1825-TSSOP14
U9 = texas:TPS773*: 250-mA LDO REGULATORS WITH RESET OUTPUT WITH 8-PIN MSOP PACKAGING Source: http://focus.ti.com/lit/ds/symlink/tps77333.pdf; MF: TEXAS INSTRUMENT CONNECTORS; MPN: TPS77350DGK; OC_FARNELL: 1412894; OC_NEWARK: 77C1226
U10 = v-reg:LD117A?*: Low drop fixed and adjustable positive voltage regulators 1 A Source: http://www.st.com/stonline/products/literature/ds/7194/ld1117axx.pdf
U12 = Ava:ADF7012: ADF7012 Multichannel ISM Band FSK/GFSK/OOK/GOOK/ASK Transmitter http://www.analog.com/static/imported-files/data_sheets/ADF7012.pdf
U13 U14 = TAMSAT:LTC4307
U15 = microchip:PIC12F675: 8-Pin FLASH-Based 8-Bit CMOS Microcontroller Precision Internal 4 MHz oscillator factory calibrated to ±1% Low Power Features: Standby Current: - 1 nA @ 2.0V, typical Operating Current: - 8.5µA @ 32 kHz, 2.0V, typical - 100µA @ 1 MHz, 2.0V, typical Watchdog Timer Current: - 300 nA @ 2.0V, typical Timer1 oscillator current: - 4µA @ 32 kHz, 2.0V, typical Analog-to-Digital Converter module: - 10-bit resolution - Programmable 4-channel input - Voltage reference input Source: http://www.microchip.com .. 41190E.pdf; MF: MICROCHIP; MPN: PIC12F675-E/SN; OC_FARNELL: 9759026; OC_NEWARK: 92C4341
U$1 U$3 U$6 = TAMSAT:SMA-KONNEKTOR
U$9 = TAMSAT:ANT_CONN_4
X1 = con-leotronics:1365-10: DUAL ROW STRAIGHT HEADER 1364 SERIES. 1.27mm x 1.27mm. Without Fixing Post. SMT Source: http://www.leotronics.co.uk/Conexcon/Data%20Sheets/sec.%20A/1364ing.pdf; OC_FARNELL: unknown; OC_NEWARK: unknown

## Net classes
0 default: clearance 0.205 mm
1 vcc: width 0.254 mm